# EasyEDA schematic Матричный светодиод.json
TITLE: Схема платы; REV: 1.0; Date: 2024-11-04; Sheet: 1/1; Company: Your Company
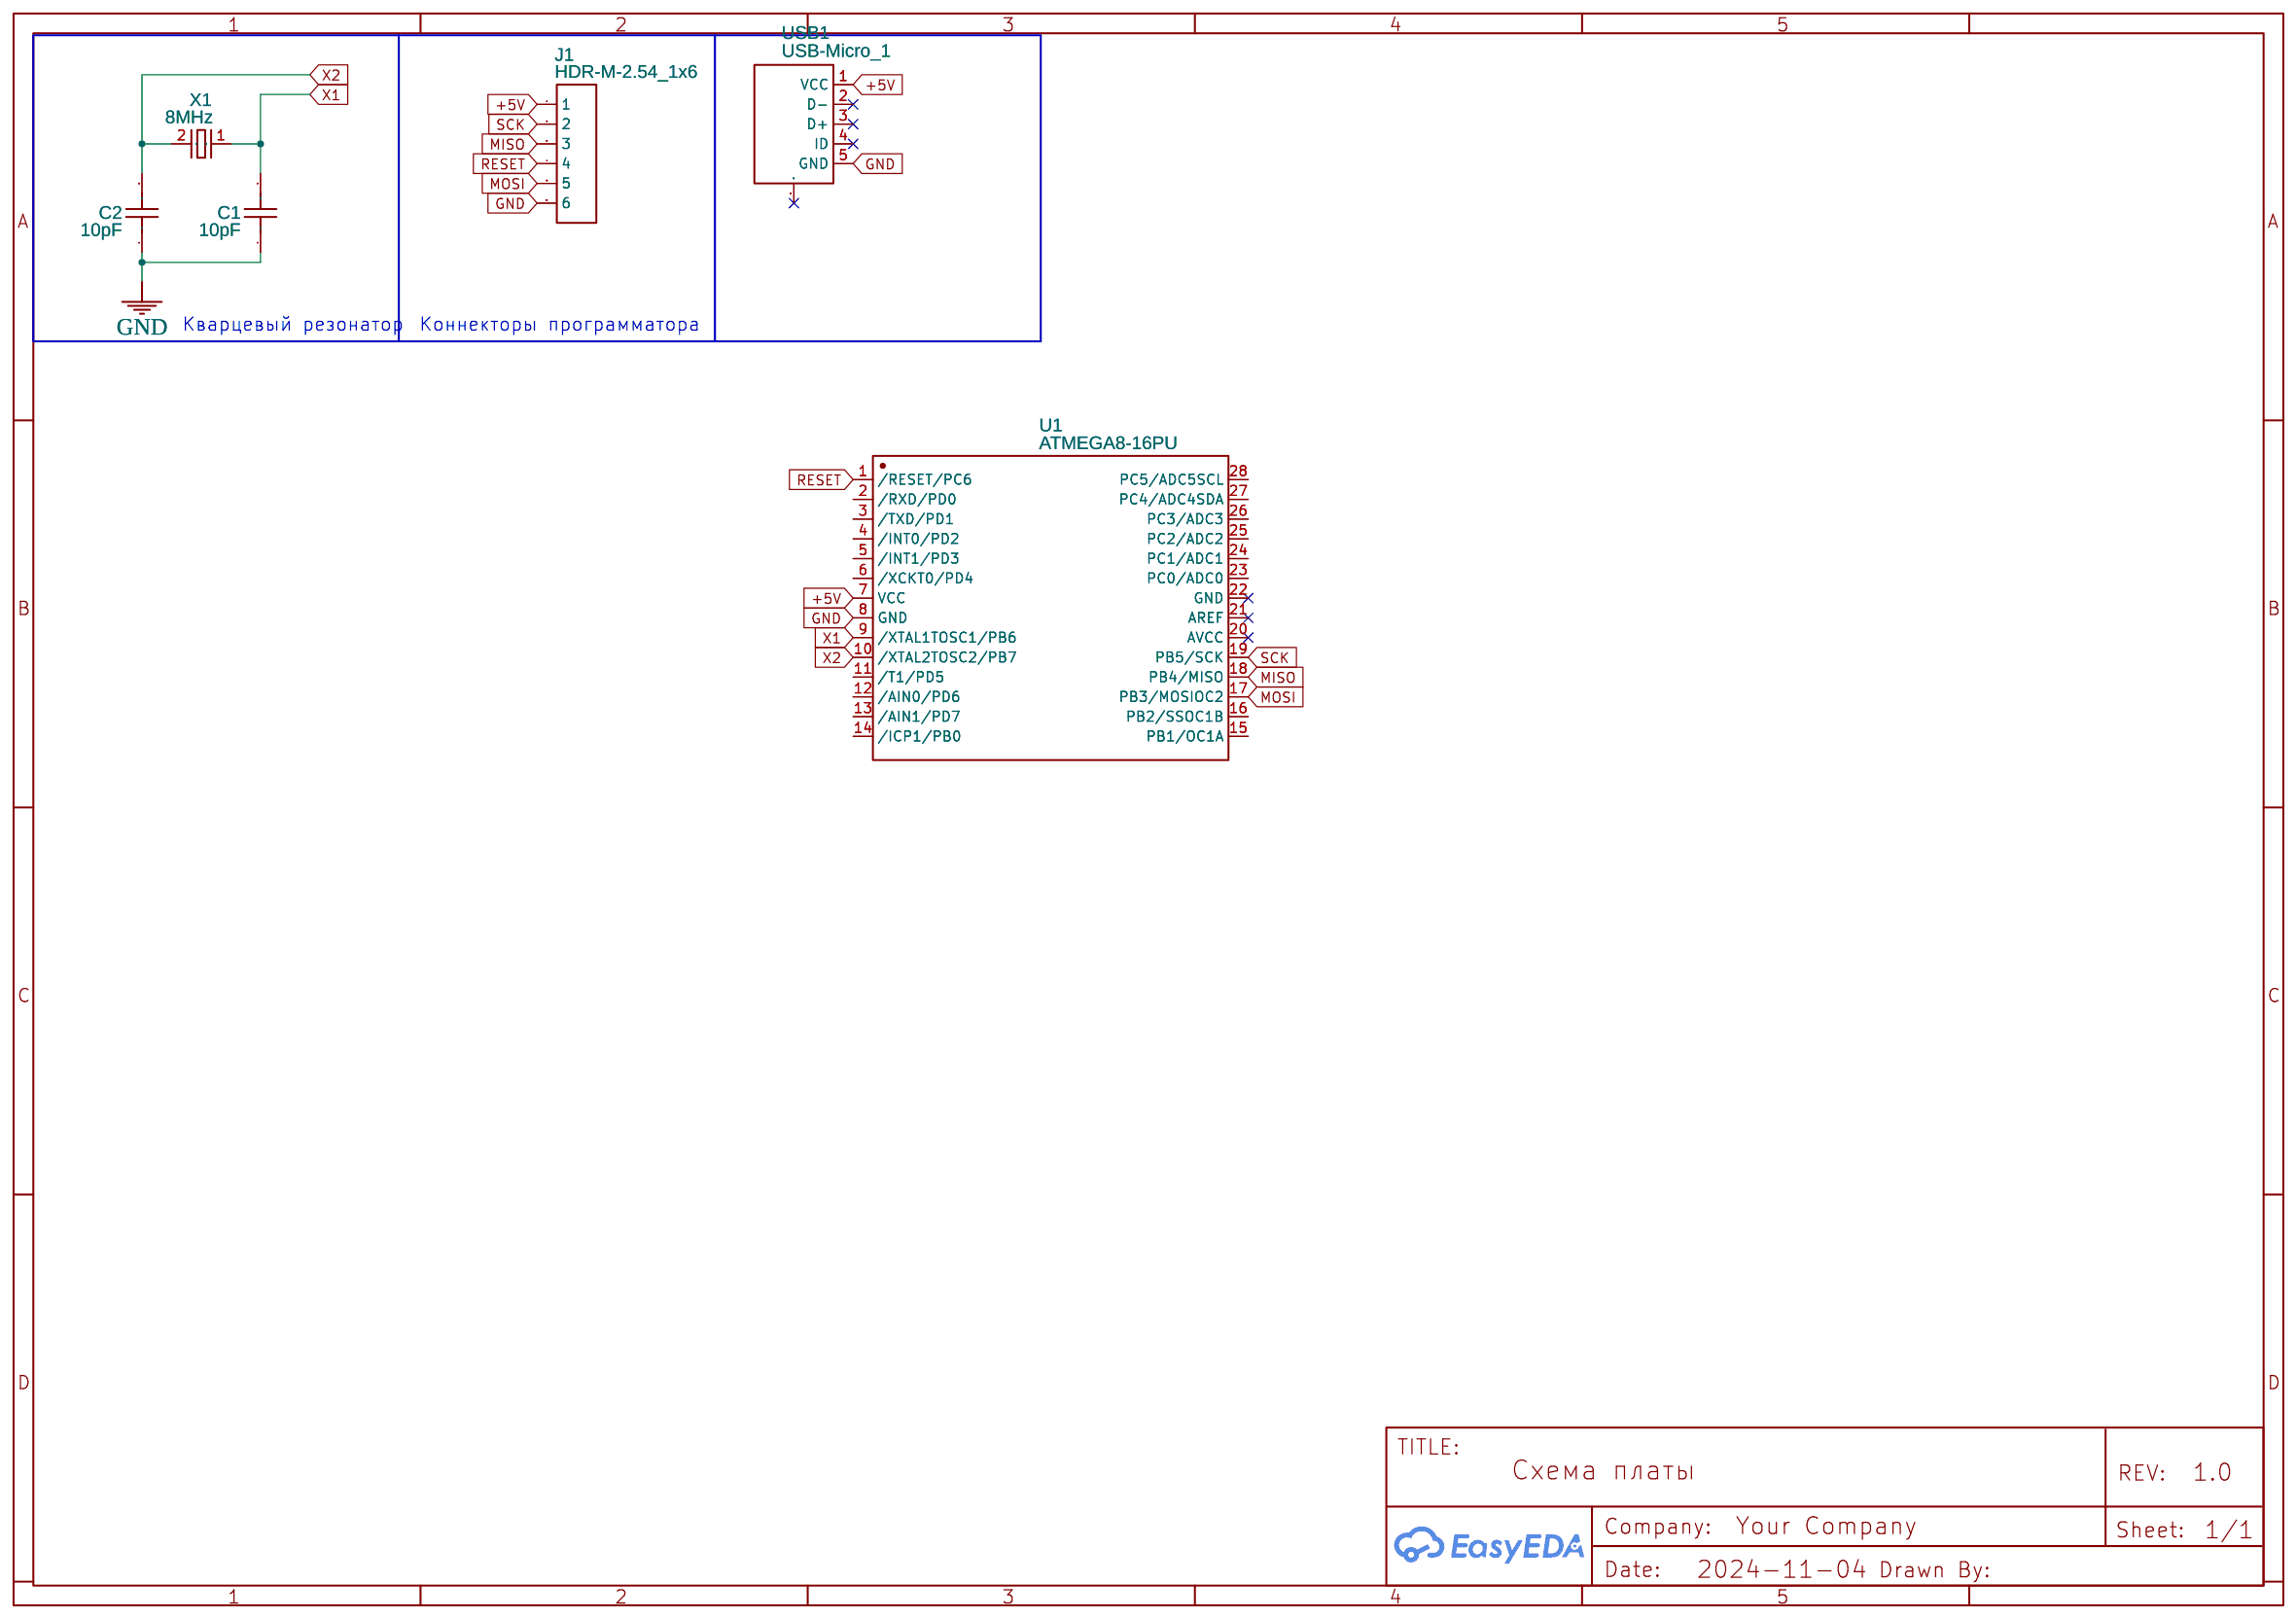
[diagram p0: schematic sheet]

## Parts
C1  10pF  [C0603]
C2  10pF  [C0603]
J1  HDR-M-2.54_1x6  [HDR-M-2.54_1X6]
U1  ATMEGA8-16PU  [DIP-28_L35.0-W6.5-P2.54-LS7.6-BL]
USB1  USB-Micro_1  [MICRO-USB-SMD_5P-P0.65-H-F_C10418]
X1  8MHz  [OSC-SMD_2P-L3.2-W2.5]

## Library data of the parts
C1 C2 = C_0603_US: Contributor: LCEDA_Lib
J1 = HDR-M-2.54_1x6: Supplier Part: C190819; Supplier: LCSC; Contributor: LCEDA_Lib
U1 = ATMEGA8-16PU: Supplier: LCSC; Manufacturer: MICROCHIP(美国微芯); Supplier Part: C112958; JLCPCB Part Class: Extended Part
USB1 = USB-Micro_1: Supplier Part: C10418; Supplier: LCSC; Manufacturer: ValuePro; Contributor: LCEDA_Lib
X1 = NX3225GD-8MHZ-STD-CRA-3: Contributor: LCSC; Supplier: LCSC; Supplier Part: C889706; Manufacturer: NDK; JLCPCB Part Class: Extended Part

## Nets
+5V: J1.1 U1.7(VCC) USB1.1(VCC)
GND: C1.1 C2.1 J1.6 U1.8(GND) USB1.5(GND)
MISO: J1.3 U1.18(PB4/MISO)
MOSI: J1.5 U1.17(PB3/MOSIOC2)
RESET: J1.4 U1.1(/RESET/PC6)
SCK: J1.2 U1.19(PB5/SCK)
X1: C1.2 U1.9(/XTAL1TOSC1/PB6) X1.1
X2: C2.2 U1.10(/XTAL2TOSC2/PB7) X1.2(GND)

Not connected (* = marked no-connect by the designer): U1 2(/RXD/PD0) 3(/TXD/PD1) 4(/INT0/PD2) 5(/INT1/PD3) 6(/XCKT0/PD4) 11(/T1/PD5) 12(/AIN0/PD6) 13(/AIN1/PD7) 14(/ICP1/PB0) 15(PB1/OC1A) 16(PB2/SSOC1B) 20(AVCC)* 21(AREF)* 22(GND)* 23(PC0/ADC0) 24(PC1/ADC1) 25(PC2/ADC2) 26(PC3/ADC3) 27(PC4/ADC4SDA) 28(PC5/ADC5SCL); USB1 0(MTN)* 2(D-)* 3(D+)* 4(ID)*

## Notes on the sheet
- Кварцевый резонатор
- Коннекторы программатора
